# EAGLE design MeArm-v5 (EAGLE 9.5.2)
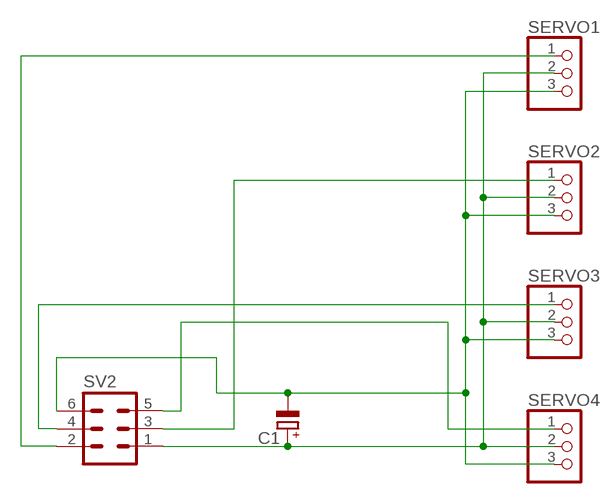
[diagram p0: schematic, sheet 1]

## Parts
C1  CPOL-EUE2.5-6  [E2,5-6]
SERVO1  PINHD-1X3  [1X03]
SERVO2  PINHD-1X3  [1X03]
SERVO3  PINHD-1X3  [1X03]
SERVO4  PINHD-1X3  [1X03]
SV2  ML6  [ML6]

## Nets
N$1: C1.+ SERVO1.2 SERVO2.2 SERVO3.2 SERVO4.2 SV2.1
N$2: SERVO4.1 SV2.5
N$3: SERVO2.1 SV2.3
N$4: SERVO1.1 SV2.2
N$5: C1.- SERVO1.3 SERVO2.3 SERVO3.3 SERVO4.3 SV2.6
N$6: SERVO3.1 SV2.4

## Library data of the parts
C1 = rcl:CPOL-EU: POLARIZED CAPACITOR, European symbol; SPICEPREFIX: C
SERVO1-SERVO4 = pinhead:PINHD-1X3: PIN HEADER
SV2 = con-harting-ml:ML6: HARTING; OC_FARNELL: unknown; OC_NEWARK: unknown

## Board
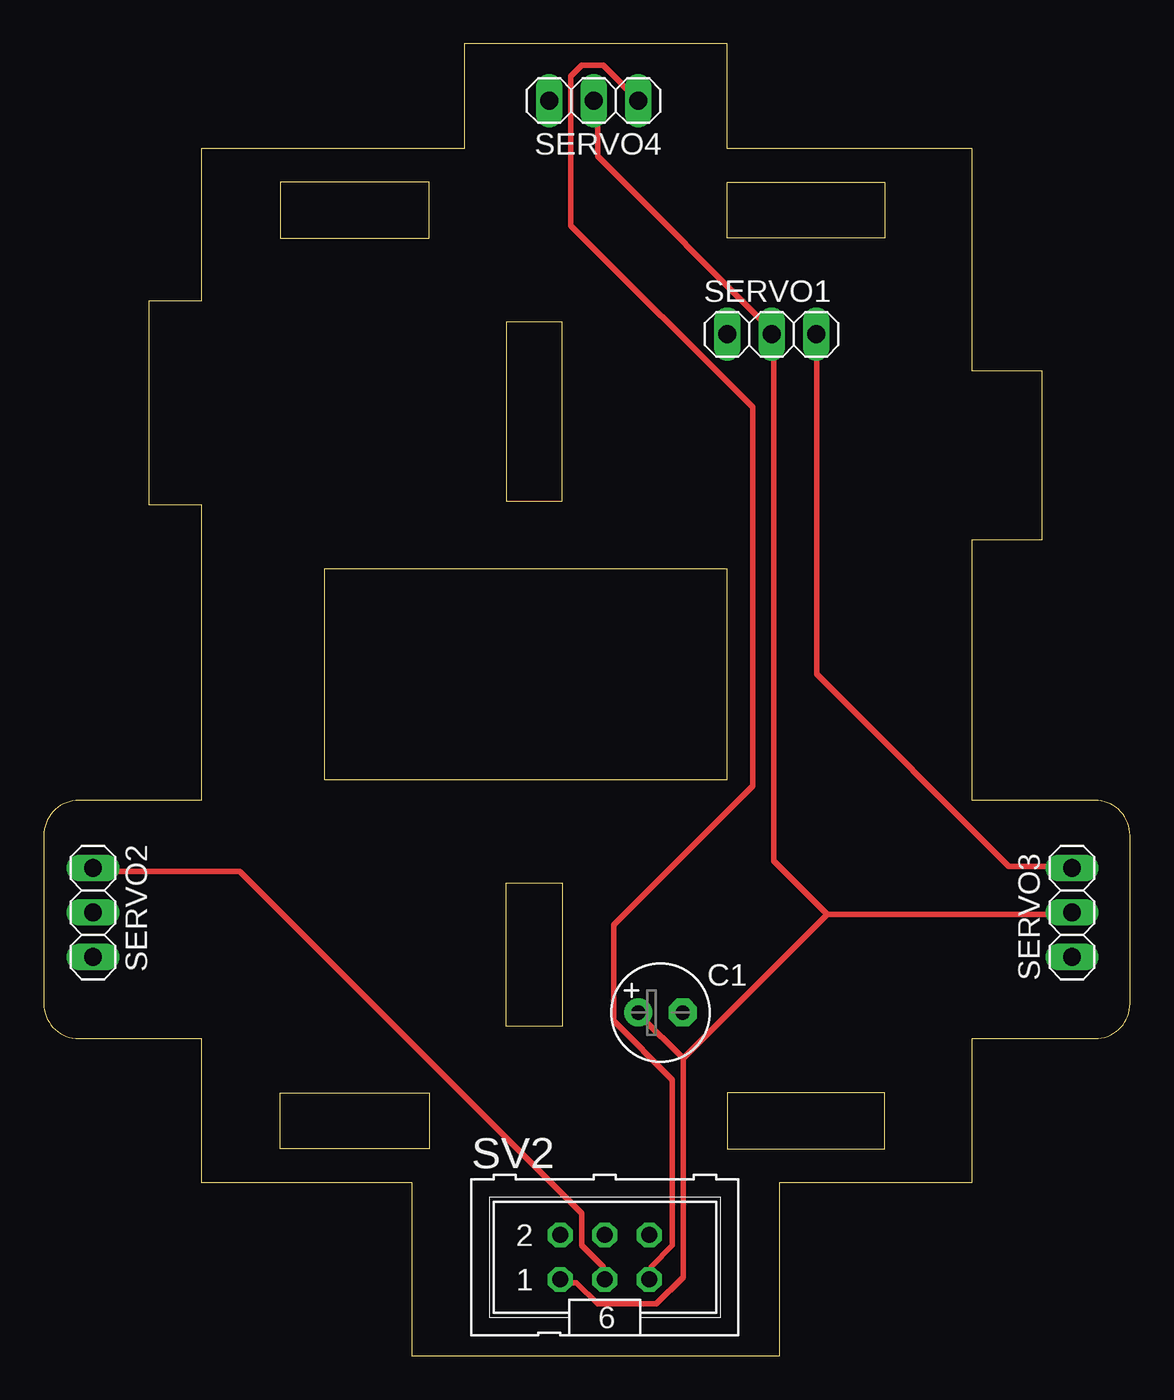
[diagram p1: board, top side]
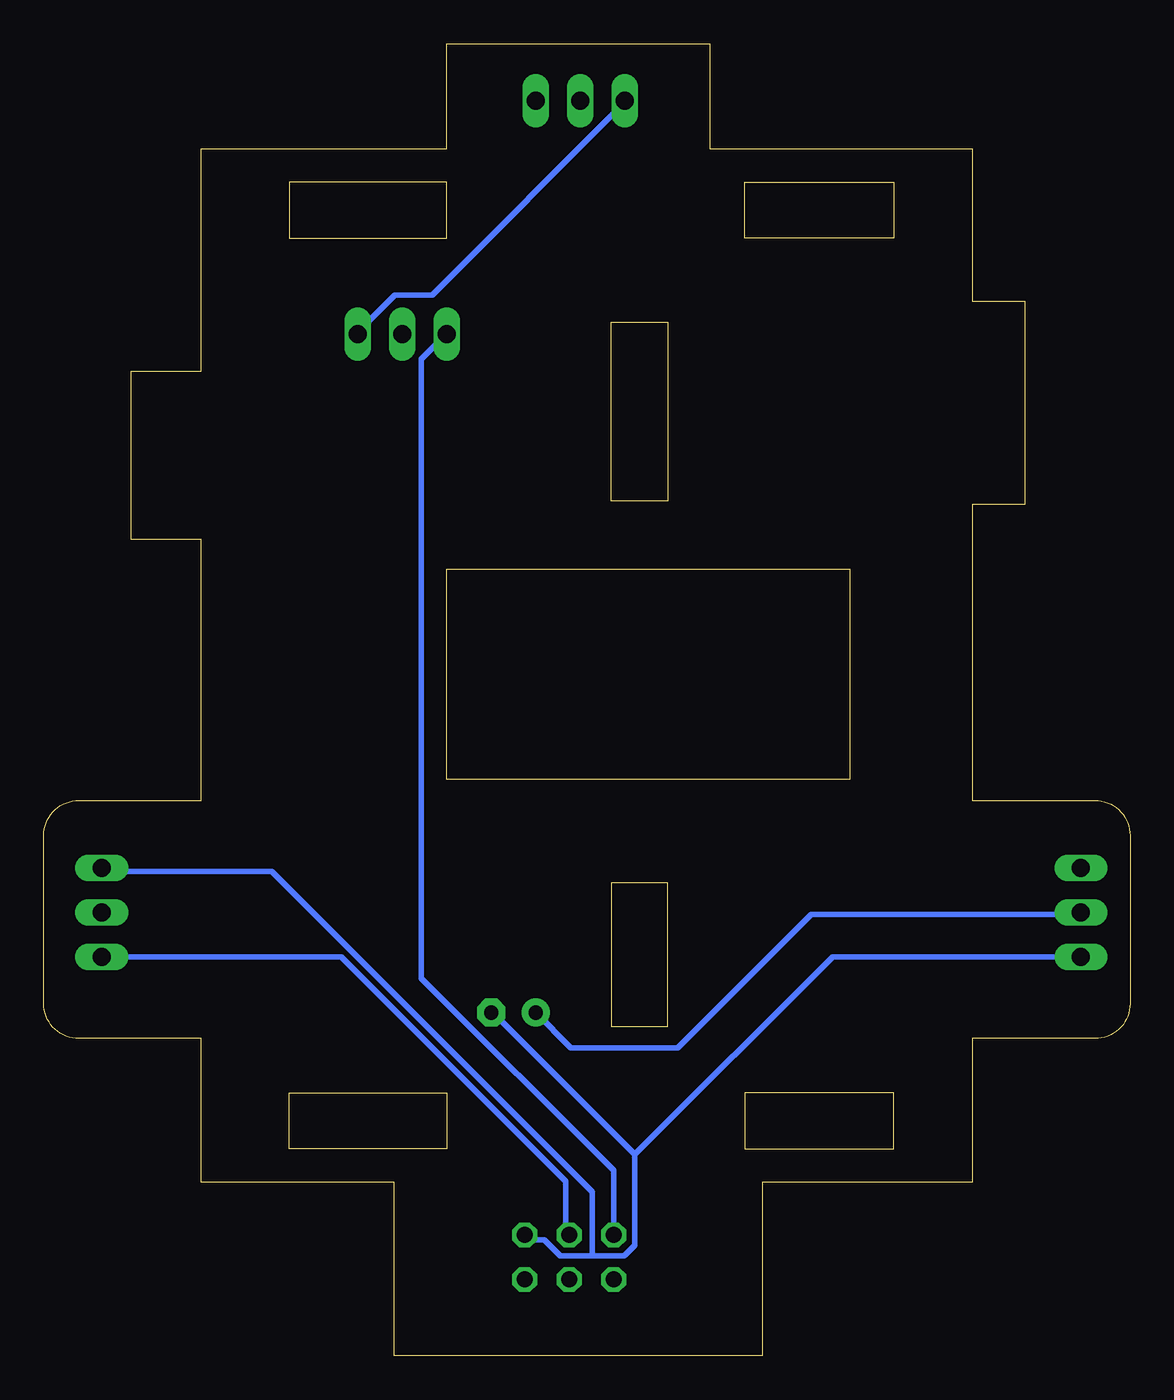
[diagram p2: board, bottom side, seen from below]

Size 62 x 74.91 mm. Coordinates in mm from the lower left corner, seen from the top.
Outline: 9,18.11 9,9.9 21,9.9 21,0 42,0 42,9.9 53,9.9 53,18.11 60,18.11 arc90 62,20.11 62,29.71 arc90 60,31.71 53,31.71 53,46.61 57,46.61 57,56.2 53,56.2 53,68.91 39,68.91 39,74.91 24,74.91 24,68.91 9,68.91 9,60.2 6,60.2 6,48.61 9,48.61 9,31.71 2,31.71 arc90 0,29.71 0,20.11 arc90 2,18.11 9,18.11
Outline: 22,11.8 13.5,11.8 13.5,15 22,15 22,11.8
Outline: 39,11.8 48,11.8 48,15 39,15 39,11.8
Outline: 39,67 48,67 48,63.8 39,63.8 39,67
Outline: 22,67 13.5,67 13.5,63.8 22,63.8 22,67
Outline: 29.6,18.8 26.4,18.8 26.4,27.01 29.6,27.01 29.6,18.8
Outline: 26.4,48.8 29.6,48.8 29.6,59.01 26.4,59.01 26.4,48.8
Outline: 39,44.91 16,44.91 16,32.91 39,32.91 39,44.91
Copper layers (1*16): Top 0.035mm / dielectric 1.5mm / Bottom 0.035mm
Design rules "default *": minimum track width 12mil, minimum drill 0.35mm, track to track 12mil, track to pad 12mil, pad to pad 6mil, via to via 6mil, smd to smd 6mil, copper to edge 40mil, drill to drill 6mil, minimum pad ring 10mil, minimum via ring 8mil, stop-mask expansion 4mil, vias tented up to drill 0mil, thermal gap 10mil

### Footprints (pad centres in the part's own frame; a part is rotated, then mirrored left to right if it is on the bottom)
E2,5-6 = drill 0.813 pad 1.6: + -1.27,0 | drill 0.813 pad 1.6 octagon: - 1.27,0
1X03 = drill 1.016 long: 1 -2.54,0; 2 0,0; 3 2.54,0
ML6 = drill 0.914 octagon: 1 -2.54,-1.27; 2 -2.54,1.27; 3 0,-1.27; 4 0,1.27; 5 2.54,-1.27; 6 2.54,1.27

### Placement (x,y rotation side)
C1  35.2,19.59 0 top
SERVO1  41.55,58.33 0 top
SERVO2  2.81,25.3 270 top
SERVO3  58.69,25.3 90 top
SERVO4  31.38,71.66 180 top
SV2  32.02,5.62 0 top

### Tracks (layer width: path | path; a pad name or v marks a point on that pad's centre or on a via)
N$1
  Top 0.305: SERVO4.2 31.61,71.53 31.61,68.48 41.67,58.43 SERVO1.2 41.67,58.12 41.67,28.25 44.72,25.2 | 36.49,16.97 36.49,4.48 34.97,2.95 31.61,2.95 30.39,4.17 29.48,4.17 SV2.1 | 36.49,16.97 34.05,19.41 C1.+ | 44.72,25.2 58.44,25.2 SERVO3.2 | 36.49,16.97 44.72,25.2
  Bottom 0.305: C1.+ 31.92,17.58 25.82,17.58 18.2,25.2 2.96,25.2 SERVO2.2
N$2
  Top 0.305: SERVO4.1 31.92,73.67 30.7,73.67 30.09,73.06 30.09,64.52 40.45,54.16 40.45,32.52 32.53,24.59 32.53,19.11 35.88,15.75 35.88,6.31 34.66,5.09 34.66,4.48 SV2.5
N$3
  Top 0.305: SV2.3 31.92,4.48 31.92,5.09 30.7,6.31 30.7,8.13 11.19,27.64 2.96,27.64 SERVO2.1
N$4
  Bottom 0.305: SV2.2 29.48,10.57 40.45,21.55 40.45,56.9 39.23,58.12 SERVO1.1
N$5
  Top 0.305: SERVO3.3 58.44,27.95 55.08,27.95 44.11,38.92 44.11,58.12 SERVO1.3
  Bottom 0.305: 30.7,5.7 28.87,5.7 28.26,6.31 28.26,11.49 | 30.7,5.7 32.53,5.7 33.44,6.61 34.36,6.61 SV2.6 | 28.26,11.49 36.19,19.41 C1.- | SERVO2.3 16.98,22.77 28.26,11.49 | SERVO4.3 28.87,71.53 39.84,60.56 41.98,60.56 44.11,58.43 SERVO1.3 | 30.7,5.7 30.7,9.35 48.99,27.64 58.44,27.64 SERVO3.3
N$6
  Bottom 0.305: SERVO3.1 45.02,22.77 32.22,9.96 32.22,6.92 SV2.4